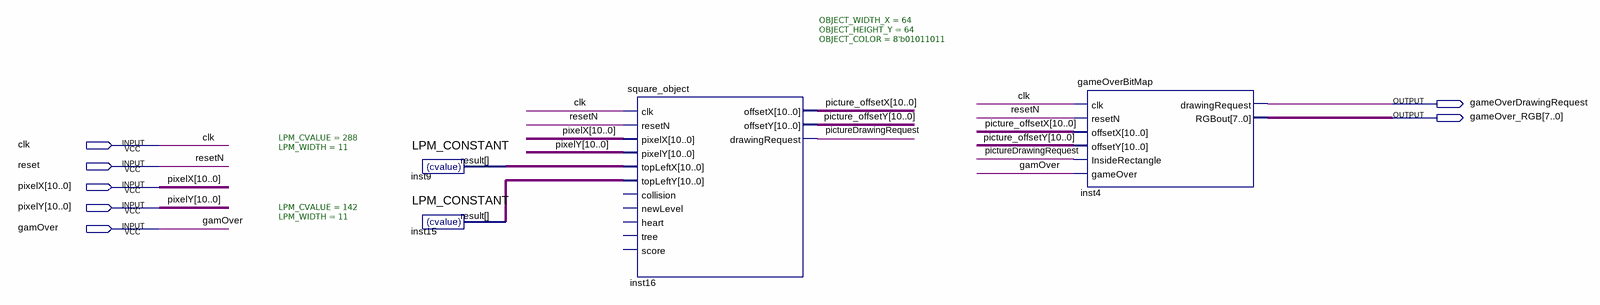
[diagram p0: schematic sheet]
// Quartus schematic gameOverBG_Block.bdf as structural Verilog: 4 symbols, 7 pins
module gameOverBG_Block (
  input  clk,
  input  reset,
  input  [10:0] pixelX,
  input  [10:0] pixelY,
  input  gamOver,
  output gameOverDrawingRequest,
  output [7:0] gameOver_RGB
);

  wire pictureDrawingRequest;
  wire [10:0] inst9_result, inst15_result, picture_offsetX, picture_offsetY;

  LPM_CONSTANT #(.LPM_CVALUE(288), .LPM_WIDTH(11)) inst9 (.result(inst9_result));
  LPM_CONSTANT #(.LPM_CVALUE(142), .LPM_WIDTH(11)) inst15 (.result(inst15_result));
  square_object #(.OBJECT_WIDTH_X(64), .OBJECT_HEIGHT_Y(64), .OBJECT_COLOR(8'b01011011)) inst16 (
    .clk(clk), .resetN(reset), .pixelX(pixelX), .pixelY(pixelY), .topLeftX(inst9_result),
    .topLeftY(inst15_result), .offsetX(picture_offsetX), .offsetY(picture_offsetY),
    .drawingRequest(pictureDrawingRequest));  // open: collision, newLevel, heart, tree, score
  gameOverBitMap inst4 (
    .clk(clk), .resetN(reset), .offsetX(picture_offsetX), .offsetY(picture_offsetY),
    .InsideRectangle(pictureDrawingRequest), .gameOver(gamOver), .drawingRequest(gameOverDrawingRequest),
    .RGBout(gameOver_RGB));

  // Other names for the same wires on the sheet: resetN = reset
endmodule
